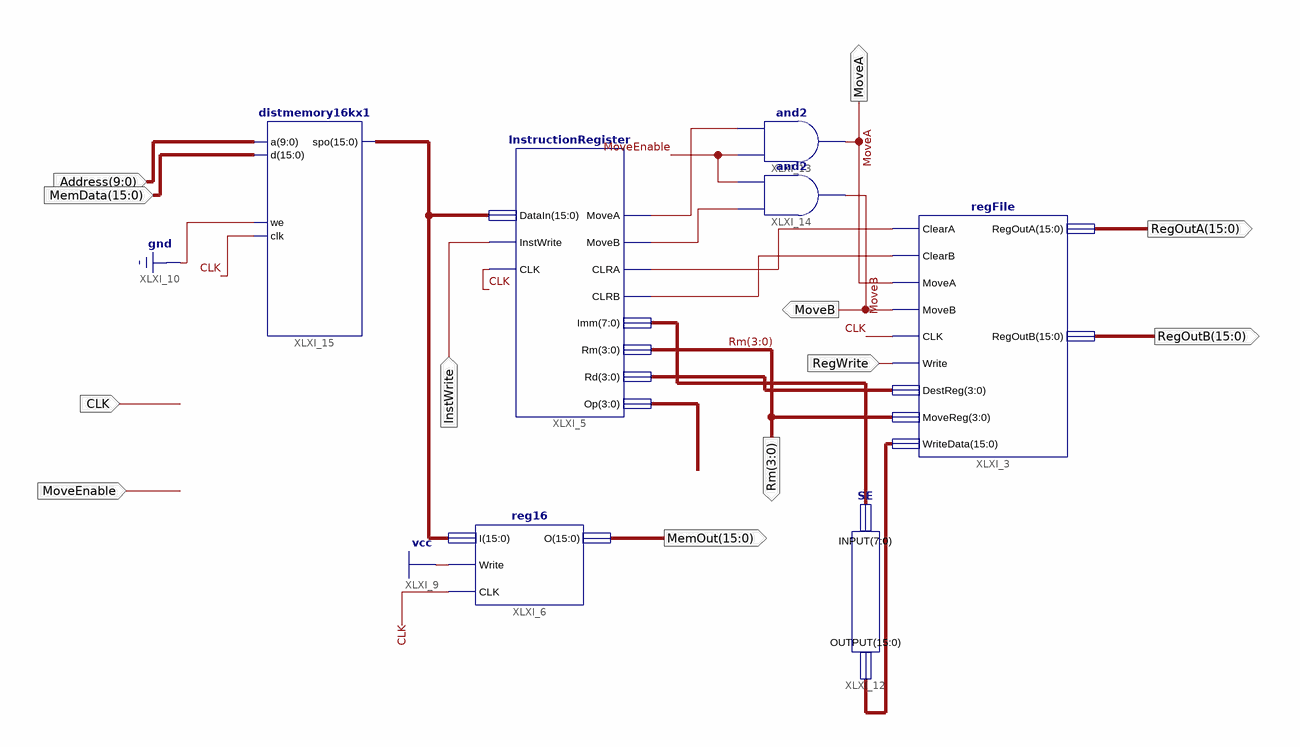
[diagram p0: schematic sheet 1]
// Xilinx ISE schematic main.sch (spartan3e) as structural Verilog: 7 symbols, 12 ports
module main (
  input  CLK,
  input  InstWrite,
  input  RegWrite,
  input  [9:0] Address,
  input  [15:0] MemData,
  input  MoveEnable,
  output [3:0] Rm,
  output [15:0] MemOut,
  output [15:0] RegOutA,
  output [15:0] RegOutB,
  output MoveB,
  output MoveA
);

  wire XLXN_5, XLXN_6, XLXN_24, XLXN_28;
  wire [3:0] XLXN_2, XLXN_8;
  wire [7:0] XLXN_7;
  wire [15:0] XLXN_11, XLXN_18;

  regFile XLXI_3 (
    .ClearA(XLXN_5), .ClearB(XLXN_6), .MoveA(MoveA), .MoveB(MoveB), .CLK(CLK), .Write(RegWrite),
    .DestReg(XLXN_2), .MoveReg(Rm), .WriteData(XLXN_18), .RegOutA(RegOutA), .RegOutB(RegOutB));
  InstructionRegister XLXI_5 (
    .DataIn(XLXN_11), .InstWrite(InstWrite), .CLK(CLK), .MoveA(XLXN_24), .MoveB(XLXN_28), .CLRA(XLXN_5),
    .CLRB(XLXN_6), .Imm(XLXN_7), .Rm(Rm), .Rd(XLXN_2), .Op(XLXN_8));
  reg16 XLXI_6 (.I(XLXN_11), .Write(1'b1), .CLK(CLK), .O(MemOut));
  SE XLXI_12 (.INPUT(XLXN_7), .OUTPUT(XLXN_18));
  and XLXI_13 (MoveA, MoveEnable, XLXN_24);
  and XLXI_14 (MoveB, XLXN_28, MoveEnable);
  distmemory16kx1 XLXI_15 (.a(Address), .d(MemData), .we(1'b0), .clk(CLK), .spo(XLXN_11));
endmodule
